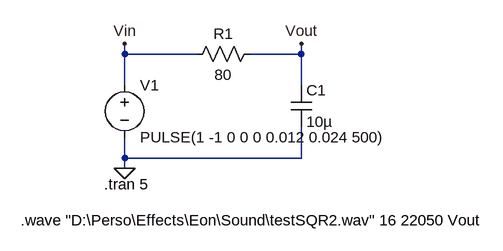
[diagram p0: schematic sqrTest.asc]
sqrTest.asc, the LTspice schematic file:
Version 4
SHEET 1 880 680
WIRE 48 64 48 48
WIRE 160 64 48 64
WIRE 320 64 320 48
WIRE 320 64 240 64
WIRE 48 112 48 64
WIRE 320 112 320 64
WIRE 48 224 48 192
WIRE 320 224 320 176
WIRE 320 224 48 224
WIRE 48 240 48 224
FLAG 48 240 0
FLAG 48 48 Vin
FLAG 320 48 Vout
SYMBOL voltage 48 96 R0
WINDOW 123 0 0 Left 2
WINDOW 39 0 0 Left 2
SYMATTR InstName V1
SYMATTR Value PULSE(1 -1 0 0 0 0.012 0.024 500)
SYMBOL res 256 48 R90
WINDOW 0 0 56 VBottom 2
WINDOW 3 32 56 VTop 2
SYMATTR InstName R1
SYMATTR Value 80
SYMBOL cap 304 112 R0
SYMATTR InstName C1
SYMATTR Value 10µ
TEXT 16 264 Left 2 !.tran 5
TEXT -112 320 Left 2 !.wave "D:\\Perso\\Effects\\Eon\\Sound\\testSQR2.wav" 16 22050 Vout

The netlist it stands for:
* sqrTest.asc
V1 Vin 0 PULSE(1 -1 0 0 0 0.012 0.024 500)
R1 Vout Vin 80
C1 Vout 0 10µ
.tran 5
.wave "D:\Perso\Effects\Eon\Sound\testSQR2.wav" 16 22050 Vout
.backanno
.end